# EAGLE design pro-cap (EAGLE 6.5.0)
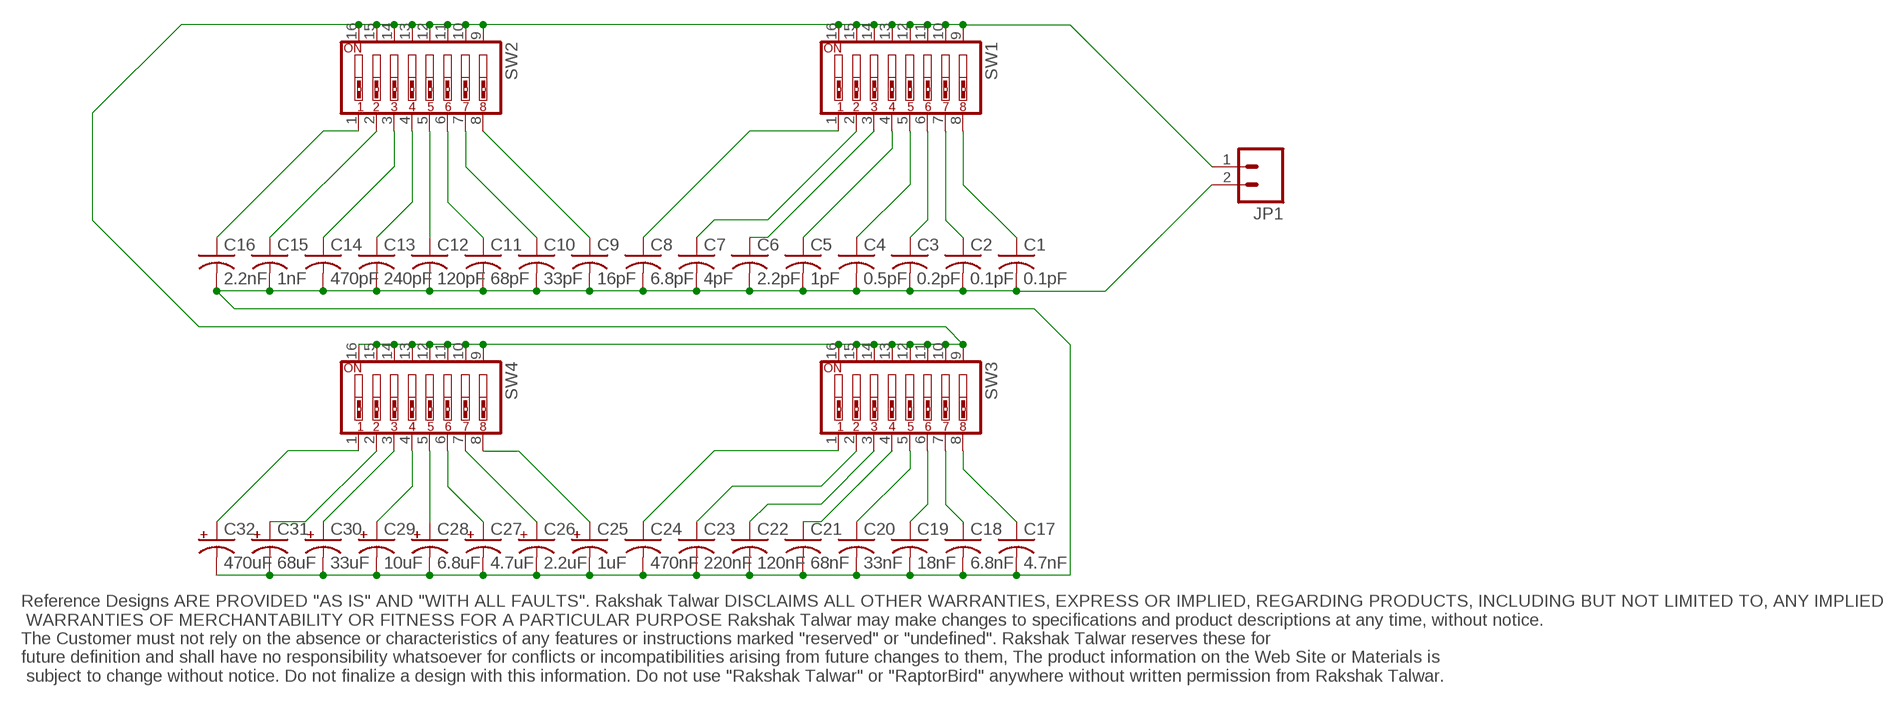
[diagram p0: schematic, sheet 1]

## Parts
C1  0.1pF  C-USC0603  [C0603]
C2  0.1pF  C-USC0603  [C0603]
C3  0.2pF  C-USC0805  [C0805]
C4  0.5pF  C-USC0603  [C0603]
C5  1pF  C-USC0805  [C0805]
C6  2.2pF  C-USC1206  [C1206]
C7  4pF  C-USC0603  [C0603]
C8  6.8pF  C-USC0805  [C0805]
C9  16pF  C-USC0603  [C0603]
C10  33pF  C-USC0603  [C0603]
C11  68pF  C-USC0603  [C0603]
C12  120pF  C-USC0805  [C0805]
C13  240pF  C-USC0603  [C0603]
C14  470pF  C-USC0805  [C0805]
C15  1nF  C-USC0603  [C0603]
C16  2.2nF  C-USC0603  [C0603]
C17  4.7nF  C-USC0603  [C0603]
C18  6.8nF  C-USC0805  [C0805]
C19  18nF  C-USC0603  [C0603]
C20  33nF  C-USC0805  [C0805]
C21  68nF  C-USC0603  [C0603]
C22  120nF  C-USC0603  [C0603]
C23  220nF  C-USC0603  [C0603]
C24  470nF  C-USC0603  [C0603]
C25  1uF  CPOL-USB  [PANASONIC_B]
C26  2.2uF  CPOL-USB  [PANASONIC_B]
C27  4.7uF  CPOL-USB  [PANASONIC_B]
C28  6.8uF  CPOL-USE1.8-4  [E1,8-4]
C29  10uF  CPOL-USE2-5  [E2-5]
C30  33uF  CPOL-USE2-5  [E2-5]
C31  68uF  CPOL-USE2.5-6  [E2,5-6]
C32  470uF  CPOL-USE5-10.5  [E5-10,5]
JP1  M023.5MM  [SCREWTERMINAL-3.5MM-2]
SW1  SW_DIP-8  [EDG-08]
SW2  SW_DIP-8  [EDG-08]
SW3  SW_DIP-8  [EDG-08]
SW4  SW_DIP-8  [EDG-08]

## Nets
N$1: C1.1 SW1.8
N$2: C2.1 SW1.7
N$3: C3.1 SW1.6
N$4: C4.1 SW1.5
N$5: C5.1 SW1.4
N$6: C6.1 SW1.3
N$7: C7.1 SW1.2
N$8: C8.1 SW1.1
N$9: C9.1 SW2.8
N$10: C10.1 SW2.7
N$11: C11.1 SW2.6
N$12: C12.1 SW2.5
N$13: C13.1 SW2.4
N$14: C14.1 SW2.3
N$15: C15.1 SW2.2
N$16: C16.1 SW2.1
N$17: C17.1 SW3.8
N$18: C18.1 SW3.7
N$19: C19.1 SW3.6
N$20: C20.1 SW3.5
N$21: C21.1 SW3.4
N$22: C22.1 SW3.3
N$23: C23.1 SW3.2
N$24: C24.1 SW3.1
N$25: C25.+ SW4.8
N$26: C26.+ SW4.7
N$27: C27.+ SW4.6
N$28: C28.+ SW4.5
N$29: C29.+ SW4.4
N$30: C30.+ SW4.3
N$31: C31.+ SW4.2
N$32: C32.+ SW4.1
N$33: JP1.1 SW1.9 SW1.10 SW1.11 SW1.12 SW1.13 SW1.14 SW1.15 SW1.16 SW2.9 SW2.10 SW2.11 SW2.12 SW2.13 SW2.14 SW2.15 SW2.16 SW3.9 SW3.10 SW3.11 SW3.12 SW3.13 SW3.14 SW3.15 SW3.16 SW4.9 SW4.10 SW4.11 SW4.12 SW4.13 SW4.14 SW4.15 SW4.16
N$34: C1.2 C2.2 C3.2 C4.2 C5.2 C6.2 C7.2 C8.2 C9.2 C10.2 C11.2 C12.2 C13.2 C14.2 C15.2 C16.2 C17.2 C18.2 C19.2 C20.2 C21.2 C22.2 C23.2 C24.2 C25.- C26.- C27.- C28.- C29.- C30.- C31.- C32.- JP1.2

## Notes on the sheet
- Reference Designs ARE PROVIDED "AS IS" AND "WITH ALL FAULTS". Rakshak Talwar DISCLAIMS ALL OTHER WARRANTIES, EXPRESS OR IMPLIED, REGARDING PRODUCTS, INCLUDING BUT NOT LIMITED TO, ANY IMPLIED
   WARRANTIES OF MERCHANTABILITY OR FITNESS FOR A PARTICULAR PURPOSE Rakshak Talwar may make changes to specifications and product descriptions at any time, without notice. 
  The Customer must not rely on the absence or characteristics of any features or instructions marked "reserved" or "undefined". Rakshak Talwar reserves these for 
  future definition and shall have no responsibility whatsoever for conflicts or incompatibilities arising from future changes to them, The product information on the Web Site or Materials is
   subject to change without notice. Do not finalize a design with this information. Do not use "Rakshak Talwar" or "RaptorBird" anywhere without written permission from Rakshak Talwar.

## Library data of the parts
C1-C24 = adafruit:C-US: CAPACITOR, American symbol
C25-C27 = adafruit:CPOL-US: POLARIZED CAPACITOR, American symbol
C28-C32 = rcl:CPOL-US: POLARIZED CAPACITOR, American symbol
JP1 = SparkFun-Connectors:M02: Header 2 Standard 2-pin 0.1" header. Use with straight break away headers (SKU : PRT-00116), right angle break away headers (PRT-00553), swiss pins (PRT-00743), machine pins (PRT-00117), and female headers (PRT-00115). Molex polarized connector foot print use with SKU : PRT-08233 with associated crimp pins and housings.
SW1-SW4 = special:SW_DIP-8: DIP SWITCH

## Board
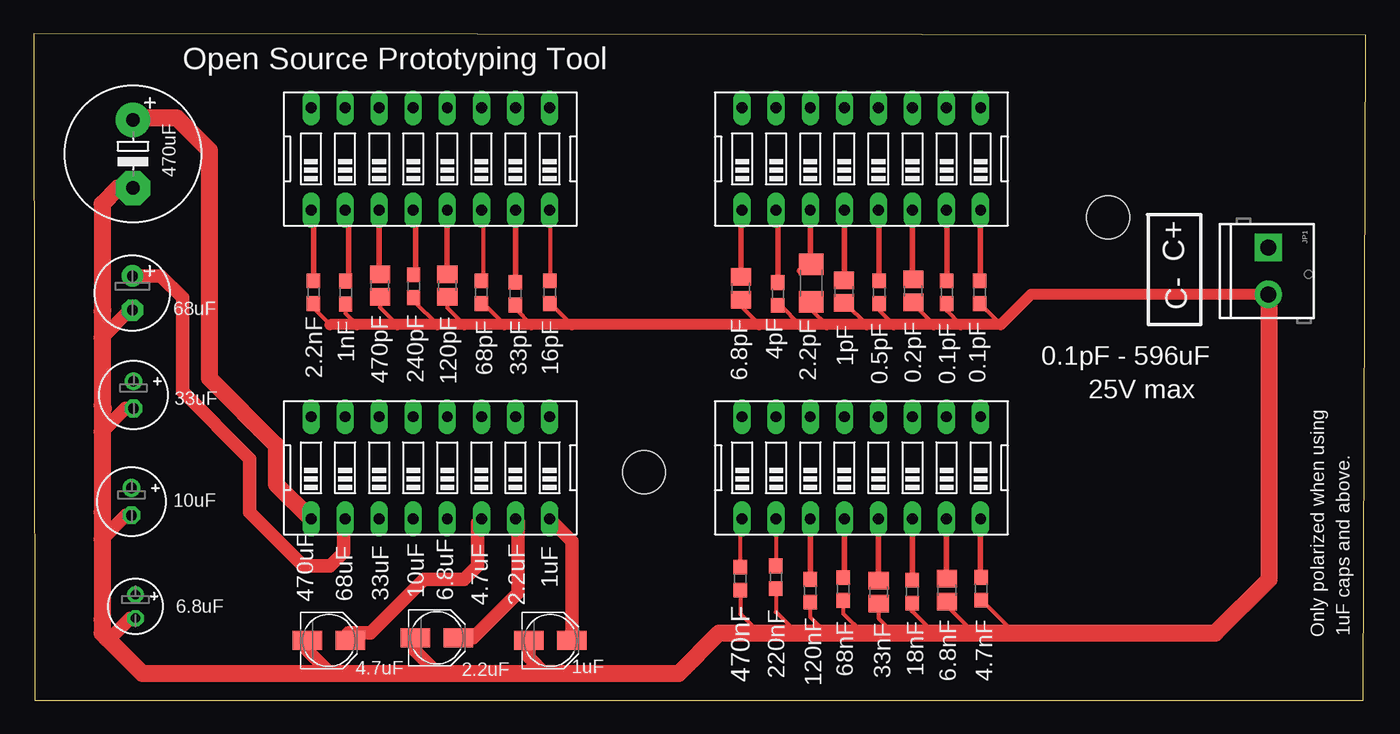
[diagram p1: board, top side]
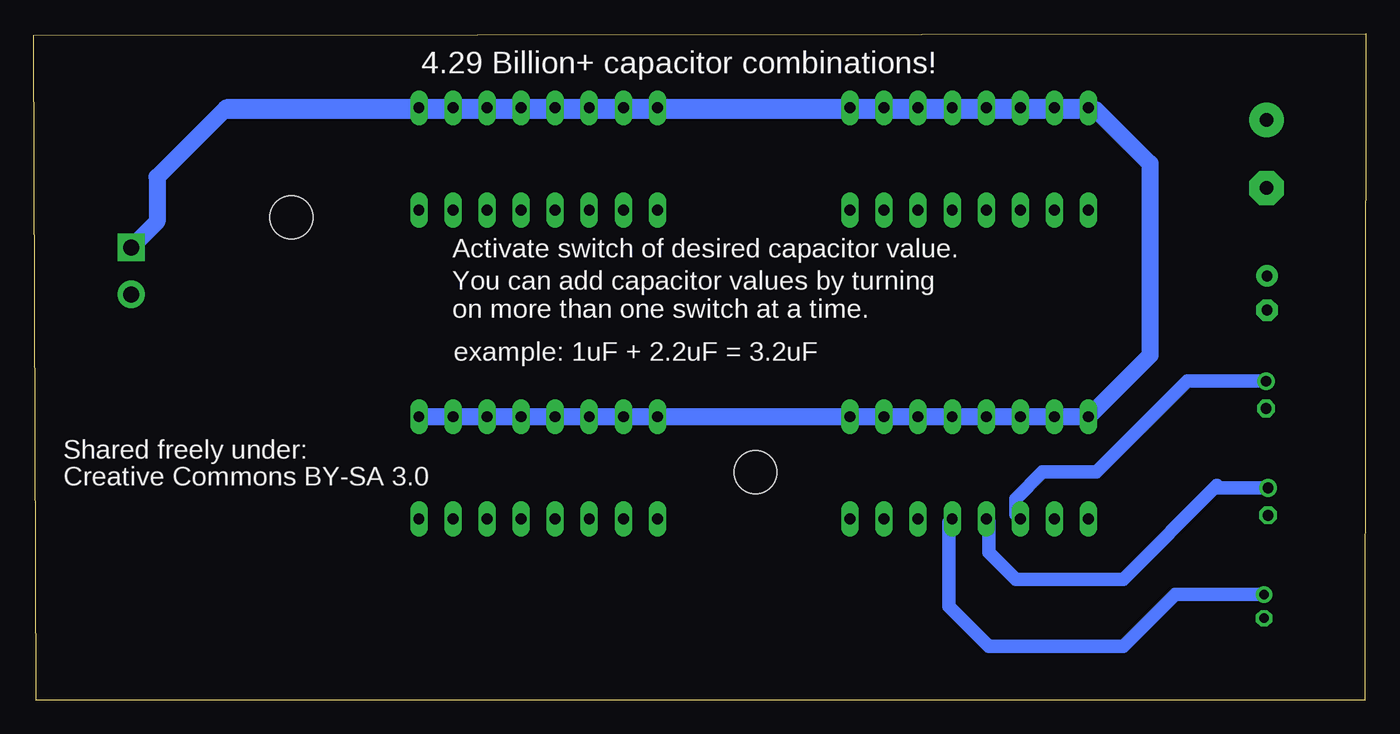
[diagram p2: board, bottom side, seen from below]

Size 99.31 x 49.7 mm. Coordinates in mm from the lower left corner, seen from the top.
Outline: 0.1,0 99.1,0 99.31,49.58 0,49.7 0.1,0
Copper layers (1*16): Top 0.035mm / dielectric 1.5mm / Bottom 0.035mm
Design rules "default": minimum track width 7mil, minimum drill 12mil, track to track 7mil, track to pad 7mil, pad to pad 7mil, via to via 7mil, smd to smd 0mil, copper to edge 20mil, drill to drill 10mil, minimum pad ring 10mil, minimum via ring 6mil, stop-mask expansion 2mil, vias tented up to drill 25mil, thermal gap 10mil
Holes 3.2 mm at 45.5,17 80.1,36

### Footprints (pad centres in the part's own frame; a part is rotated, then mirrored left to right if it is on the bottom)
C0603 = smd 1.1 x 1: 1 -0.85,0; 2 0.85,0
C0805 = smd 1.3 x 1.5: 1 -0.85,0; 2 0.85,0
C1206 = smd 1.6 x 1.8: 1 -1.4,0; 2 1.4,0
PANASONIC_B = smd 2.2 x 1.4: + 1.6,0; - -1.6,0
E1,8-4 = drill 0.711 pad 1.168: + -0.889,0 | drill 0.711 pad 1.168 octagon: - 0.889,0
E2-5 = drill 0.813 pad 1.27: + -1.016,0 | drill 0.813 pad 1.27 octagon: - 1.016,0
E2,5-6 = drill 0.813 pad 1.6: + -1.27,0 | drill 0.813 pad 1.6 octagon: - 1.27,0
E5-10,5 = drill 1.016 pad 2.54: + -2.54,0 | drill 1.016 pad 2.54 octagon: - 2.54,0
SCREWTERMINAL-3.5MM-2 = drill 1.2 pad 2.032 square: 1 0,0 | drill 1.2 pad 2.032: 2 3.5,0
EDG-08 = drill 0.813 long: 1 -8.89,-3.81; 2 -6.35,-3.81; 3 -3.81,-3.81; 4 -1.27,-3.81; 5 1.27,-3.81; 6 3.81,-3.81; 7 6.35,-3.81; 8 8.89,-3.81; 9 8.89,3.81; 10 6.35,3.81; 11 3.81,3.81; 12 1.27,3.81; 13 -1.27,3.81; 14 -3.81,3.81; 15 -6.35,3.81; 16 -8.89,3.81

### Placement (x,y rotation side)
C1  70.52,30.41 270 top
C2  68.07,30.41 270 top
C3  65.57,30.51 270 top
C4  63.02,30.41 270 top
C5  60.41,30.46 270 top
C6  57.96,31.11 270 top
C7  55.48,30.29 270 top
C8  52.72,30.71 270 top
C9  38.47,30.41 270 top
C10  35.92,30.31 270 top
C11  33.37,30.41 270 top
C12  30.84,30.91 270 top
C13  28.33,30.86 270 top
C14  25.82,30.91 270 top
C15  23.26,30.39 270 top
C16  20.87,30.41 270 top
C17  70.62,8.31 270 top
C18  68.07,8.21 270 top
C19  65.49,8.09 270 top
C20  62.99,8.06 270 top
C21  60.34,8.29 270 top
C22  57.88,8.16 270 top
C23  55.33,9.16 270 top
C24  52.68,9.06 270 top
C25  38.52,4.45 0 top
C26  30.07,4.65 0 top
C27  22.02,4.45 0 top
C28  7.59,6.99 270 top
C29  7.3,14.8 270 top
C30  7.45,22.76 270 top
C31  7.37,30.35 270 top
C32  7.41,40.72 270 top
JP1  92.03,33.75 270 top
SW1  61.7,40.35 0 top
SW2  29.57,40.35 0 top
SW3  61.7,17.32 0 top
SW4  29.57,17.32 0 top

### Tracks (layer width: path | path; a pad name or v marks a point on that pad's centre or on a via)
N$1
  Top 0.406: SW1.8 70.59,31.33 C1.1
N$2
  Top 0.406: C2.1 68.07,36.52 SW1.7
N$3
  Top 0.406: SW1.6 65.51,31.42 C3.1
N$4
  Top 0.406: C4.1 63.02,36.49 SW1.5
N$5
  Top 0.406: SW1.4 60.43,31.33 C5.1
N$6
  Top 0.406: C6.1 57.45,32 57.1,32 58.1,33 57.89,33.21 SW1.3
N$7
  Top 0.406: C7.1 55.48,36.41 SW1.2
N$8
  Top 0.406: C8.1 52.72,36.45 SW1.1
N$9
  Top 0.254: 38.51,31.73 C9.1 | 38.51,36.74 SW2.8
  Top 0.305: 38.51,36.74 38.51,31.73
N$10
  Top 0.406: C10.1 SW2.7
N$11
  Top 0.254: 33.5,31.73 C11.1 | 33.5,36.74 SW2.6
  Top 0.305: 33.5,36.74 33.5,31.39 C11.1
N$12
  Top 0.406: C12.1 SW2.5
N$13
  Top 0.254: 28.49,31.73 C13.1 | 28.49,36.74 SW2.4
  Top 0.406: 28.49,36.74 28.49,31.87 C13.1
N$14
  Top 0.406: SW2.3 25.76,31.82 C14.1
N$15
  Top 0.254: 23.48,31.73 C15.1 | 23.48,36.74 SW2.2
  Top 0.406: 23.48,36.74 23.48,31.46 C15.1
N$16
  Top 0.406: C16.1 20.87,36.35 SW2.1
N$17
  Top 0.305: C17.1 70.59,9.19
  Top 0.406: SW3.8 70.59,9.19
N$18
  Top 0.305: 68.05,9.08 C18.1
  Top 0.406: SW3.7 68.05,9.08
N$19
  Top 0.305: 65.51,8.96 C19.1
  Top 0.406: SW3.6 65.51,8.96
N$20
  Top 0.406: SW3.5 62.97,8.93 C20.1
N$21
  Top 0.406: SW3.4 60.43,8.95 C21.1
N$22
  Top 0.305: C22.1
  Top 0.406: SW3.3 C22.1 57.89,8.72
N$23
  Top 0.305: SW3.2 55.35,10.03 C23.1
N$24
  Top 0.305: C24.1 52.68,13.38 SW3.1
N$25
  Top 1.016: C25.+ 40.12,11.85 SW4.8
N$26
  Top 1.016: C26.+ 32.75,4.65 36.1,8 36.1,13.33 SW4.7
N$27
  Top 0.254: 23.48,5.01 C27.+
  Top 1.016: 23.48,5.01 25.11,5.01 29.1,9 32.1,9 33.1,10 33.1,13.23 SW4.6
N$28
  Bottom 1.016: SW4.5 31.1,13.25 31.1,7 28.1,4 18.1,4 14.22,7.88 C28.+
N$29
  Bottom 1.016: SW4.4 28.1,13.31 28.1,11 26.1,9 18.1,9 11.1,16 11.1,15.82 C29.+
N$30
  Bottom 1.016: C30.+ 13.32,23.78 20.1,17 24.1,17 26.1,15 26.1,13.85 SW4.3
N$31
  Top 1.016: C31.+ 9.48,31.62 11.1,30 11.1,23 16.1,18 16.1,14 20.1,10 22.1,10 23.1,11 23.1,13.39 SW4.2
N$32
  Top 0.254: 8.45,43.42 C32.+
  Top 1.27: 8.45,43.42 10.68,43.42 13.1,41 13.1,24 18.1,19 18.1,16.09 SW4.1
N$33
  Bottom 1.27: SW2.16 SW2.15 SW2.14 SW2.13 SW2.12 SW2.11 | SW2.11 34.1,44.16 34.1,44 33.38,44 SW2.11 | SW2.11 SW2.10 SW2.9 SW1.16 SW1.15 SW1.14 SW1.13 | SW1.13 61.1,44.16 61.1,44 60.43,44 SW1.13 | SW1.13 SW1.12 SW1.11 | SW1.11 66.1,44.16 66.1,44 65.51,44 SW1.11 | SW1.11 SW1.10 SW1.9 84.94,44.16 85.1,44 | SW3.9 SW3.10 SW3.11 SW3.12 SW3.13 SW3.14 SW3.15 SW3.16 SW4.9 SW4.10 SW4.11 SW4.12 SW4.13 SW4.14 SW4.15 SW4.16 16.1,25.71 16.1,40 20.1,44 85.1,44 | 85.1,44 90.1,39 90.1,35.68 JP1.1
N$34
  Top 0.254: 28.49,30.06 C13.2
  Top 0.305: C2.2 68.07,29.03 69.1,28 | C3.2 65.57,29.53 67.1,28 | C4.2 63.02,29.08 64.1,28 | C7.2 55.66,29.44 57.1,28 | C6.2 57.96,29.14 59.1,28 | C5.2 60.49,29.61 62.1,28 | C8.2 52.72,29.38 54.1,28 | C1.2 70.54,29.56 72.1,28 | C9.2 38.54,29.56 40.1,28 | C10.2 35.92,29.18 37.1,28 | C11.2 33.54,29.56 35.1,28 | C12.2 30.84,29.26 32.1,28 | C13.2 28.33,29.77 30.1,28 | C14.2 25.82,29.28 27.1,28 | 23.54,29.56 23.24,29.56 C15.2 23.26,28.84 24.1,28 | C16.2 20.87,29.23 22.1,28 | C22.2 57.88,6.22 59.1,5 | C21.2 60.34,6.46 61.8,5 | C23.2 55.33,6.57 56.9,5 | C20.2 62.99,6.11 64.1,5 | 67.1,5 65.46,6.64 65.46,7.21 65.31,7.21 65.1,7 65.25,7 C19.2 | 70.1,5 68.07,7.03 C18.2 | 73.1,5 70.64,7.46 C17.2 | C24.2 52.68,6.42 54.1,5
  Top 0.813: 60.31,29.71 C5.2 | 62.97,29.61 C4.2 | 67.97,29.66 C2.2 | 62.96,7.24 C20.2 | JP1.2 74.35,30.25 72.1,28 69.1,28 67.1,28 64.1,28 62.1,28 59.1,28 57.1,28 54.1,28 40.1,28 37.1,28 35.1,28 32.1,28 30.1,28 27.1,28 24.1,28 22.1,28
  Top 1.016: 5.36,21.74 5.1,22 | 5.2,6.1 5.1,6 5.1,6.1 | 36.92,2.18 37.1,2 | 5.1,13.78 5.1,14 | C31.- 7.18,29.08 5.1,27 | C30.- 6.84,21.74 5.1,20 | C29.- 6.88,13.78 5.1,12 | C28.- 7.2,6.1 5.6,4.5 | C27.- 20.42,3.68 22.1,2 | C26.- 28.47,3.63 30.1,2 | C25.- 36.92,3.18 38.1,2
  Top 1.27: C32.- 6.28,38.18 5.1,37 5.1,29 | 7.29,29 C31.- | 5.18,29.08 5.1,29 | 5.1,29 5.1,27 5.1,22 5.1,20 5.1,14 5.1,12 5.1,6 5.1,5 5.6,4.5 8.1,2 22.1,2 30.1,2 37.1,2 38.1,2 48.1,2 51.1,5 54.1,5 56.9,5 59.1,5 61.8,5 64.1,5 67.1,5 70.1,5 73.1,5 88.1,5 92.1,9 92.1,30.18 JP1.2

### Text on the board
_tsilk: Open Source Prototyping Tool | 470uF | C+ | 68uF | C- | 0.1pF - 596uF | 33uF | 25V max | 10uF | 10uF | 6.8uF | Only polarized when using | 1uF caps and above. | 4.7uF | 2.2uF | 1uF | Reference Designs ARE PROVIDED "AS IS" AND "WITH ALL FAULTS". Rakshak Talwar DISCLAIMS ALL OTHER WARRANTIES, EXPRESS OR IMPLIED, REGARDING PRODUCTS, INCLUDING BUT NOT LIMITED TO, ANY IMPLIED / WARRANTIES OF MERCHANTABILITY OR FITNESS FOR A PARTICULAR PURPOSE Rakshak Talwar may make changes to specifications and product descriptions at any time, without notice. / The Customer must not rely on the absence or characteristics of any features or instructions marked "reserved" or "undefined". Rakshak Talwar reserves these for / future definition and shall have no responsibility whatsoever for conflicts or incompatibilities arising from future changes to them, The product information on the Web Site or Materials is / subject to change without notice. Do not finalize a design with this information. / Do not use "Rakshak Talwar" or "RaptorBird" anywhere without written permission from Rakshak Talwar.
_bsilk: 4.29 Billion+ capacitor combinations! | Activate switch of desired capacitor value. | You can add capacitor values by turning | on more than one switch at a time. | example: 1uF + 2.2uF = 3.2uF | Shared freely under: | Creative Commons BY-SA 3.0